# Vivado block design hdmi_directpassthr_woi, xc7z020clg484-1, Vivado 2017.2
# (continued, part 2 of 3)
current_bd_instance /color_video_pass/color_video_pass_fifo_wr_en
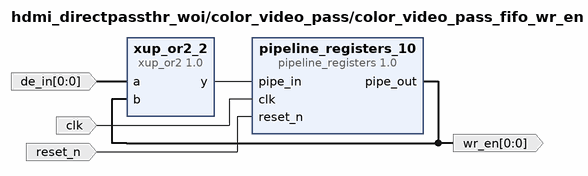
[diagram p24: block diagram inside /color_video_pass/color_video_pass_fifo_wr_en]
create_bd_pin -dir I clk
create_bd_pin -dir O -from 0 -to 0 wr_en
create_bd_pin -dir I -from 0 -to 0 de_in
create_bd_pin -dir I reset_n

create_bd_cell -type ip -vlnv SchuylerEldridge:user:pipeline_registers:1.0 pipeline_registers_10
set_property -dict {CONFIG.NUMBER_OF_STAGES 1 CONFIG.BIT_WIDTH 1} [get_bd_cells pipeline_registers_10]
create_bd_cell -type ip -vlnv xilinx.com:xup:xup_or2:1.0 xup_or2_2

# ---- hierarchy /color_video_pass/color_video_pass_fifo_rd_en ----
current_bd_instance /color_video_pass/color_video_pass_fifo_rd_en
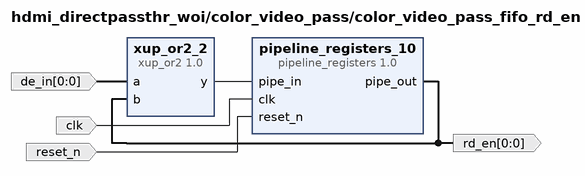
[diagram p25: block diagram inside /color_video_pass/color_video_pass_fifo_rd_en]
create_bd_pin -dir I clk
create_bd_pin -dir O -from 0 -to 0 rd_en
create_bd_pin -dir I -from 0 -to 0 de_in
create_bd_pin -dir I reset_n

create_bd_cell -type ip -vlnv SchuylerEldridge:user:pipeline_registers:1.0 pipeline_registers_10
set_property -dict {CONFIG.NUMBER_OF_STAGES 1 CONFIG.BIT_WIDTH 1} [get_bd_cells pipeline_registers_10]
create_bd_cell -type ip -vlnv xilinx.com:xup:xup_or2:1.0 xup_or2_2

# ---- hierarchy /four_signal_registering2 ----
current_bd_instance /four_signal_registering2
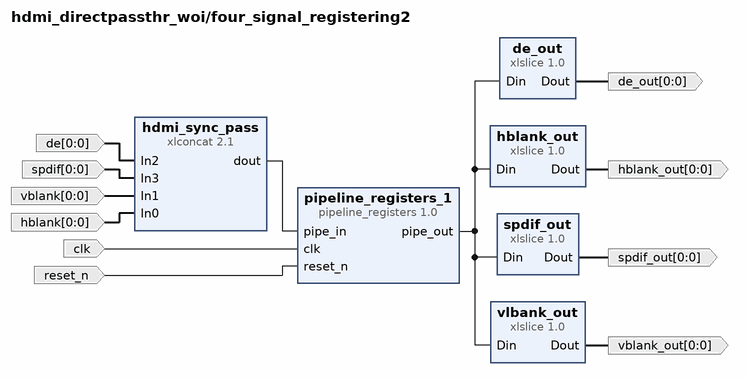
[diagram p26: block diagram inside /four_signal_registering2]
create_bd_pin -dir I -from 0 -to 0 de
create_bd_pin -dir I -from 0 -to 0 spdif
create_bd_pin -dir I -from 0 -to 0 vblank
create_bd_pin -dir I clk
create_bd_pin -dir I -from 0 -to 0 hblank
create_bd_pin -dir I reset_n
create_bd_pin -dir O -from 0 -to 0 hblank_out
create_bd_pin -dir O -from 0 -to 0 vblank_out
create_bd_pin -dir O -from 0 -to 0 de_out
create_bd_pin -dir O -from 0 -to 0 spdif_out

create_bd_cell -type ip -vlnv SchuylerEldridge:user:pipeline_registers:1.0 pipeline_registers_1
set_property -dict {CONFIG.NUMBER_OF_STAGES 1 CONFIG.BIT_WIDTH 4} [get_bd_cells pipeline_registers_1]
create_bd_cell -type ip -vlnv xilinx.com:ip:xlslice:1.0 de_out
set_property -dict {CONFIG.DIN_TO 2 CONFIG.DIN_FROM 2 CONFIG.DIN_WIDTH 4} [get_bd_cells de_out]
create_bd_cell -type ip -vlnv xilinx.com:ip:xlslice:1.0 hblank_out
set_property -dict {CONFIG.DIN_WIDTH 4} [get_bd_cells hblank_out]
create_bd_cell -type ip -vlnv xilinx.com:ip:xlconcat:2.1 hdmi_sync_pass
set_property -dict {CONFIG.NUM_PORTS 4 CONFIG.dout_width 4} [get_bd_cells hdmi_sync_pass]
create_bd_cell -type ip -vlnv xilinx.com:ip:xlslice:1.0 spdif_out
set_property -dict {CONFIG.DIN_TO 3 CONFIG.DIN_FROM 3 CONFIG.DIN_WIDTH 4} [get_bd_cells spdif_out]
create_bd_cell -type ip -vlnv xilinx.com:ip:xlslice:1.0 vlbank_out
set_property -dict {CONFIG.DIN_TO 1 CONFIG.DIN_FROM 1 CONFIG.DIN_WIDTH 4} [get_bd_cells vlbank_out]

# ---- hierarchy /fmc_imageon_hdmi_output_0 ----
current_bd_instance /fmc_imageon_hdmi_output_0
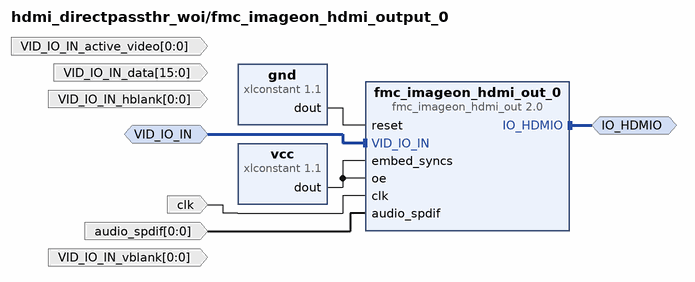
[diagram p27: block diagram inside /fmc_imageon_hdmi_output_0]
create_bd_intf_pin -mode Slave -vlnv xilinx.com:interface:vid_io_rtl:1.0 VID_IO_IN
create_bd_intf_pin -mode Master -vlnv avnet.com:interface:avnet_hdmi_rtl:1.0 IO_HDMIO
create_bd_pin -dir I clk
create_bd_pin -dir I -from 0 -to 0 audio_spdif
create_bd_pin -dir I -from 0 -to 0 VID_IO_IN_hblank
create_bd_pin -dir I -from 15 -to 0 VID_IO_IN_data
create_bd_pin -dir I -from 0 -to 0 VID_IO_IN_vblank
create_bd_pin -dir I -from 0 -to 0 VID_IO_IN_active_video

create_bd_cell -type ip -vlnv avnet:fmc_imageon:fmc_imageon_hdmi_out:2.0 fmc_imageon_hdmi_out_0
create_bd_cell -type ip -vlnv xilinx.com:ip:xlconstant:1.1 vcc
create_bd_cell -type ip -vlnv xilinx.com:ip:xlconstant:1.1 gnd

# ---- hierarchy /ycbcr2gray ----
current_bd_instance /ycbcr2gray
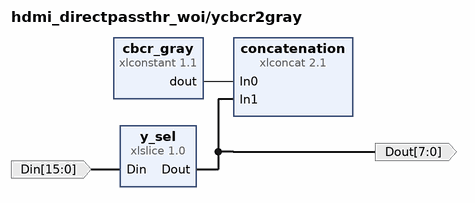
[diagram p28: block diagram inside /ycbcr2gray]
create_bd_pin -dir I -from 15 -to 0 Din
create_bd_pin -dir O -from 7 -to 0 Dout

create_bd_cell -type ip -vlnv xilinx.com:ip:xlconstant:1.1 cbcr_gray
set_property -dict {CONFIG.CONST_WIDTH 8 CONFIG.CONST_VAL 128} [get_bd_cells cbcr_gray]
create_bd_cell -type ip -vlnv xilinx.com:ip:xlconcat:2.1 concatenation
set_property -dict {CONFIG.IN0_WIDTH 8 CONFIG.IN1_WIDTH 8 CONFIG.dout_width 16} [get_bd_cells concatenation]
create_bd_cell -type ip -vlnv xilinx.com:ip:xlslice:1.0 y_sel
set_property -dict {CONFIG.DIN_TO 8 CONFIG.DIN_FROM 15 CONFIG.DIN_WIDTH 16 CONFIG.DOUT_WIDTH 8} [get_bd_cells y_sel]

# ---- hierarchy /ycbcr2mem_unit ----
current_bd_instance /ycbcr2mem_unit
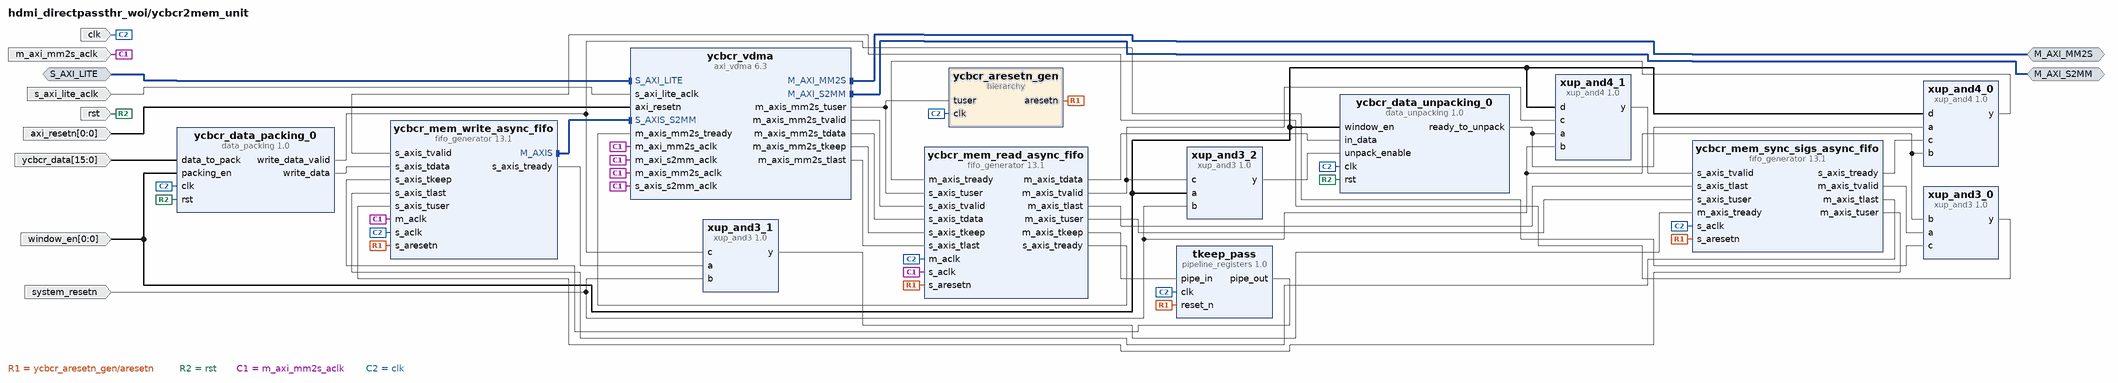
[diagram p29: block diagram inside /ycbcr2mem_unit]
create_bd_intf_pin -mode Slave -vlnv xilinx.com:interface:aximm_rtl:1.0 S_AXI_LITE
create_bd_intf_pin -mode Master -vlnv xilinx.com:interface:aximm_rtl:1.0 M_AXI_MM2S
create_bd_intf_pin -mode Master -vlnv xilinx.com:interface:aximm_rtl:1.0 M_AXI_S2MM
create_bd_pin -dir I -type clk s_axi_lite_aclk
create_bd_pin -dir I -from 0 -to 0 -type rst axi_resetn
create_bd_pin -dir I rst
create_bd_pin -dir I system_resetn
create_bd_pin -dir I -type clk m_axi_mm2s_aclk
create_bd_pin -dir I clk
create_bd_pin -dir I -from 0 -to 0 window_en
create_bd_pin -dir I -from 15 -to 0 ycbcr_data

create_bd_cell -type ip -vlnv xilinx.com:xup:xup_and4:1.0 xup_and4_0
create_bd_cell -type ip -vlnv xilinx.com:xup:xup_and3:1.0 xup_and3_0
create_bd_cell -type ip -vlnv xilinx.com:xup:xup_and4:1.0 xup_and4_1
create_bd_cell -type ip -vlnv xilinx.com:xup:xup_and3:1.0 xup_and3_1
create_bd_cell -type ip -vlnv xilinx.com:xup:xup_and3:1.0 xup_and3_2
create_bd_cell -type ip -vlnv NEU-ESL:user:data_unpacking:1.0 ycbcr_data_unpacking_0
create_bd_cell -type ip -vlnv NEU-ESL:user:data_packing:1.0 ycbcr_data_packing_0
set_property -dict {CONFIG.OUT_DATA_WIDTH 32 CONFIG.IN_DATA_WIDTH 16} [get_bd_cells ycbcr_data_packing_0]
create_bd_cell -type ip -vlnv SchuylerEldridge:user:pipeline_registers:1.0 tkeep_pass
set_property -dict {CONFIG.NUMBER_OF_STAGES 2 CONFIG.BIT_WIDTH 4} [get_bd_cells tkeep_pass]
create_bd_cell -type hier ycbcr_aresetn_gen
create_bd_cell -type ip -vlnv xilinx.com:ip:axi_vdma:6.3 ycbcr_vdma
set_property -dict [list \
  CONFIG.c_m_axi_mm2s_data_width 32 \
  CONFIG.c_m_axi_s2mm_data_width 32 \
  CONFIG.c_num_fstores 1 \
  CONFIG.c_use_s2mm_fsync 0 \
  CONFIG.c_mm2s_genlock_mode 0 \
  CONFIG.c_s2mm_genlock_mode 0 \
  CONFIG.c_mm2s_linebuffer_depth 4096 \
  CONFIG.c_s2mm_linebuffer_depth 4096 \
  CONFIG.c_mm2s_max_burst_length 256 \
  CONFIG.c_s2mm_max_burst_length 256 \
] [get_bd_cells ycbcr_vdma]
create_bd_cell -type ip -vlnv xilinx.com:ip:fifo_generator:13.1 ycbcr_mem_read_async_fifo
set_property -dict [list \
  CONFIG.INTERFACE_TYPE AXI_STREAM \
  CONFIG.Full_Flags_Reset_Value 1 \
  CONFIG.Clock_Type_AXI Independent_Clock \
  CONFIG.TDATA_NUM_BYTES 4 \
  CONFIG.TUSER_WIDTH 1 \
  CONFIG.Enable_TLAST true \
  CONFIG.HAS_TKEEP true \
  CONFIG.FIFO_Implementation_wach Independent_Clocks_Distributed_RAM \
  CONFIG.FIFO_Implementation_wdch Independent_Clocks_Block_RAM \
  CONFIG.FIFO_Implementation_wrch Independent_Clocks_Distributed_RAM \
  CONFIG.FIFO_Implementation_rach Independent_Clocks_Distributed_RAM \
  CONFIG.FIFO_Implementation_rdch Independent_Clocks_Block_RAM \
  CONFIG.FIFO_Implementation_axis Independent_Clocks_Block_RAM \
  CONFIG.Input_Depth_axis 512 \
  CONFIG.Underflow_Flag_AXI true \
  CONFIG.Overflow_Flag_AXI true \
] [get_bd_cells ycbcr_mem_read_async_fifo]
create_bd_cell -type ip -vlnv xilinx.com:ip:fifo_generator:13.1 ycbcr_mem_sync_sigs_async_fifo
set_property -dict [list \
  CONFIG.INTERFACE_TYPE AXI_STREAM \
  CONFIG.Full_Flags_Reset_Value 1 \
  CONFIG.Clock_Type_AXI Common_Clock \
  CONFIG.TDATA_NUM_BYTES 0 \
  CONFIG.TUSER_WIDTH 1 \
  CONFIG.Enable_TLAST true \
  CONFIG.FIFO_Implementation_wach Common_Clock_Distributed_RAM \
  CONFIG.FIFO_Implementation_wrch Common_Clock_Distributed_RAM \
  CONFIG.FIFO_Implementation_rach Common_Clock_Distributed_RAM \
  CONFIG.Input_Depth_axis 16 \
  CONFIG.Underflow_Flag_AXI true \
  CONFIG.Overflow_Flag_AXI true \
] [get_bd_cells ycbcr_mem_sync_sigs_async_fifo]
create_bd_cell -type ip -vlnv xilinx.com:ip:fifo_generator:13.1 ycbcr_mem_write_async_fifo
set_property -dict [list \
  CONFIG.INTERFACE_TYPE AXI_STREAM \
  CONFIG.Full_Flags_Reset_Value 1 \
  CONFIG.Clock_Type_AXI Independent_Clock \
  CONFIG.TDATA_NUM_BYTES 4 \
  CONFIG.TUSER_WIDTH 1 \
  CONFIG.Enable_TLAST true \
  CONFIG.HAS_TKEEP true \
  CONFIG.FIFO_Implementation_wach Independent_Clocks_Distributed_RAM \
  CONFIG.FIFO_Implementation_wdch Independent_Clocks_Block_RAM \
  CONFIG.FIFO_Implementation_wrch Independent_Clocks_Distributed_RAM \
  CONFIG.FIFO_Implementation_rach Independent_Clocks_Distributed_RAM \
  CONFIG.FIFO_Implementation_rdch Independent_Clocks_Block_RAM \
  CONFIG.FIFO_Implementation_axis Independent_Clocks_Block_RAM \
  CONFIG.Input_Depth_axis 512 \
  CONFIG.Underflow_Flag_AXI true \
  CONFIG.Overflow_Flag_AXI true \
] [get_bd_cells ycbcr_mem_write_async_fifo]

# ---- hierarchy /ycbcr2mem_unit/ycbcr_aresetn_gen ----
current_bd_instance /ycbcr2mem_unit/ycbcr_aresetn_gen
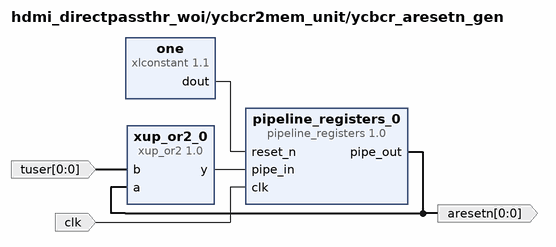
[diagram p30: block diagram inside /ycbcr2mem_unit/ycbcr_aresetn_gen]
create_bd_pin -dir I clk
create_bd_pin -dir I -from 0 -to 0 tuser
create_bd_pin -dir O -from 0 -to 0 aresetn

create_bd_cell -type ip -vlnv xilinx.com:xup:xup_or2:1.0 xup_or2_0
create_bd_cell -type ip -vlnv SchuylerEldridge:user:pipeline_registers:1.0 pipeline_registers_0
set_property -dict {CONFIG.NUMBER_OF_STAGES 1 CONFIG.BIT_WIDTH 1} [get_bd_cells pipeline_registers_0]
create_bd_cell -type ip -vlnv xilinx.com:ip:xlconstant:1.1 one

# ---- hierarchy /smth_pass_sel ----
current_bd_instance /smth_pass_sel
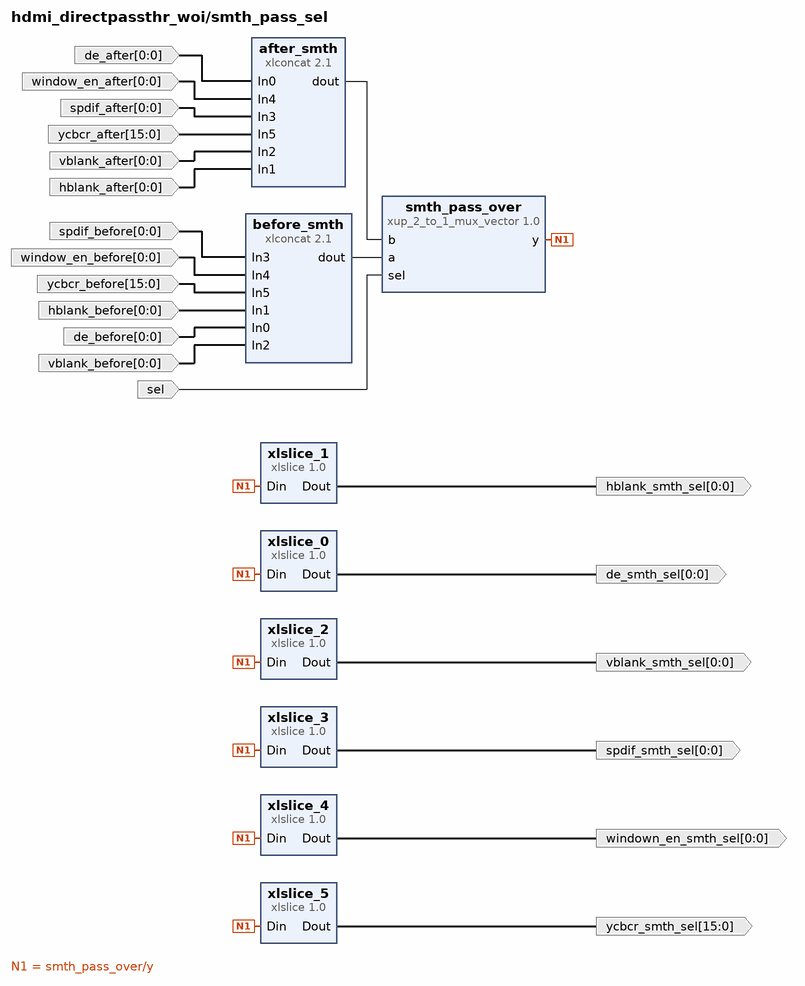
[diagram p31: block diagram inside /smth_pass_sel]
create_bd_pin -dir I -from 0 -to 0 de_after
create_bd_pin -dir I -from 0 -to 0 window_en_after
create_bd_pin -dir I -from 0 -to 0 spdif_after
create_bd_pin -dir I -from 15 -to 0 ycbcr_after
create_bd_pin -dir I -from 0 -to 0 vblank_after
create_bd_pin -dir I -from 0 -to 0 hblank_after
create_bd_pin -dir I -from 0 -to 0 spdif_before
create_bd_pin -dir I -from 0 -to 0 window_en_before
create_bd_pin -dir I -from 15 -to 0 ycbcr_before
create_bd_pin -dir I -from 0 -to 0 hblank_before
create_bd_pin -dir I -from 0 -to 0 de_before
create_bd_pin -dir I -from 0 -to 0 vblank_before
create_bd_pin -dir I sel
create_bd_pin -dir O -from 0 -to 0 hblank_smth_sel
create_bd_pin -dir O -from 0 -to 0 de_smth_sel
create_bd_pin -dir O -from 0 -to 0 vblank_smth_sel
create_bd_pin -dir O -from 0 -to 0 spdif_smth_sel
create_bd_pin -dir O -from 0 -to 0 windown_en_smth_sel
create_bd_pin -dir O -from 15 -to 0 ycbcr_smth_sel

create_bd_cell -type ip -vlnv xilinx.com:xup:xup_2_to_1_mux_vector:1.0 smth_pass_over
set_property -dict {CONFIG.DELAY 0 CONFIG.SIZE 21} [get_bd_cells smth_pass_over]
create_bd_cell -type ip -vlnv xilinx.com:ip:xlconcat:2.1 before_smth
set_property -dict {CONFIG.NUM_PORTS 6 CONFIG.IN5_WIDTH 16 CONFIG.dout_width 21} [get_bd_cells before_smth]
create_bd_cell -type ip -vlnv xilinx.com:ip:xlconcat:2.1 after_smth
set_property -dict {CONFIG.NUM_PORTS 6 CONFIG.IN5_WIDTH 16 CONFIG.dout_width 21} [get_bd_cells after_smth]
create_bd_cell -type ip -vlnv xilinx.com:ip:xlslice:1.0 xlslice_0
set_property -dict {CONFIG.DIN_WIDTH 21} [get_bd_cells xlslice_0]
create_bd_cell -type ip -vlnv xilinx.com:ip:xlslice:1.0 xlslice_1
set_property -dict {CONFIG.DIN_TO 1 CONFIG.DIN_FROM 1 CONFIG.DIN_WIDTH 21} [get_bd_cells xlslice_1]
create_bd_cell -type ip -vlnv xilinx.com:ip:xlslice:1.0 xlslice_2
set_property -dict {CONFIG.DIN_TO 2 CONFIG.DIN_FROM 2 CONFIG.DIN_WIDTH 21} [get_bd_cells xlslice_2]
create_bd_cell -type ip -vlnv xilinx.com:ip:xlslice:1.0 xlslice_3
set_property -dict {CONFIG.DIN_TO 3 CONFIG.DIN_FROM 3 CONFIG.DIN_WIDTH 21} [get_bd_cells xlslice_3]
create_bd_cell -type ip -vlnv xilinx.com:ip:xlslice:1.0 xlslice_4
set_property -dict {CONFIG.DIN_TO 4 CONFIG.DIN_FROM 4 CONFIG.DIN_WIDTH 21} [get_bd_cells xlslice_4]
create_bd_cell -type ip -vlnv xilinx.com:ip:xlslice:1.0 xlslice_5
set_property -dict {CONFIG.DIN_TO 5 CONFIG.DIN_FROM 20 CONFIG.DIN_WIDTH 21 CONFIG.DOUT_WIDTH 16} [get_bd_cells xlslice_5]

# ---- hierarchy /morph_pass_sel ----
current_bd_instance /morph_pass_sel
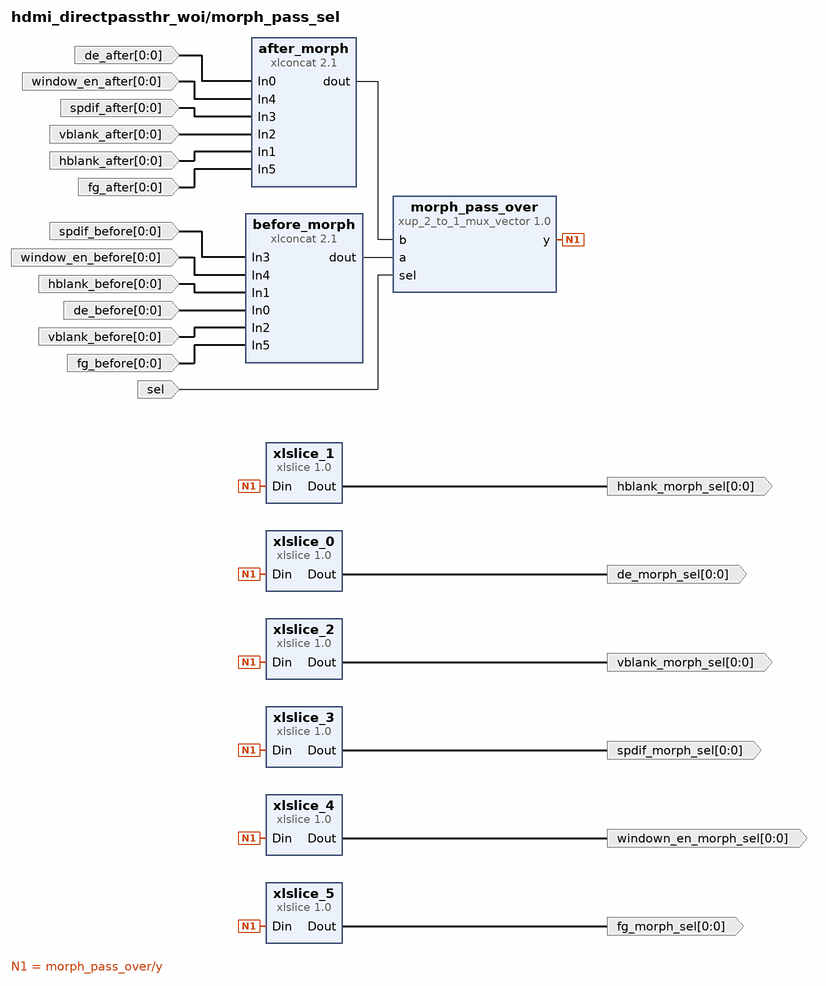
[diagram p32: block diagram inside /morph_pass_sel]
create_bd_pin -dir I -from 0 -to 0 de_after
create_bd_pin -dir I -from 0 -to 0 window_en_after
create_bd_pin -dir I -from 0 -to 0 spdif_after
create_bd_pin -dir I -from 0 -to 0 vblank_after
create_bd_pin -dir I -from 0 -to 0 hblank_after
create_bd_pin -dir I -from 0 -to 0 spdif_before
create_bd_pin -dir I -from 0 -to 0 window_en_before
create_bd_pin -dir I -from 0 -to 0 hblank_before
create_bd_pin -dir I -from 0 -to 0 de_before
create_bd_pin -dir I -from 0 -to 0 vblank_before
create_bd_pin -dir I sel
create_bd_pin -dir O -from 0 -to 0 hblank_morph_sel
create_bd_pin -dir O -from 0 -to 0 de_morph_sel
create_bd_pin -dir O -from 0 -to 0 vblank_morph_sel
create_bd_pin -dir O -from 0 -to 0 spdif_morph_sel
create_bd_pin -dir O -from 0 -to 0 windown_en_morph_sel
create_bd_pin -dir I -from 0 -to 0 fg_before
create_bd_pin -dir I -from 0 -to 0 fg_after
create_bd_pin -dir O -from 0 -to 0 fg_morph_sel

create_bd_cell -type ip -vlnv xilinx.com:xup:xup_2_to_1_mux_vector:1.0 morph_pass_over
set_property -dict {CONFIG.DELAY 0 CONFIG.SIZE 6} [get_bd_cells morph_pass_over]
create_bd_cell -type ip -vlnv xilinx.com:ip:xlconcat:2.1 after_morph
set_property -dict {CONFIG.NUM_PORTS 6 CONFIG.IN5_WIDTH 1 CONFIG.dout_width 6} [get_bd_cells after_morph]
create_bd_cell -type ip -vlnv xilinx.com:ip:xlconcat:2.1 before_morph
set_property -dict {CONFIG.NUM_PORTS 6 CONFIG.IN5_WIDTH 1 CONFIG.dout_width 6} [get_bd_cells before_morph]
create_bd_cell -type ip -vlnv xilinx.com:ip:xlslice:1.0 xlslice_0
set_property -dict {CONFIG.DIN_WIDTH 6} [get_bd_cells xlslice_0]
create_bd_cell -type ip -vlnv xilinx.com:ip:xlslice:1.0 xlslice_1
set_property -dict {CONFIG.DIN_TO 1 CONFIG.DIN_FROM 1 CONFIG.DIN_WIDTH 6} [get_bd_cells xlslice_1]
create_bd_cell -type ip -vlnv xilinx.com:ip:xlslice:1.0 xlslice_2
set_property -dict {CONFIG.DIN_TO 2 CONFIG.DIN_FROM 2 CONFIG.DIN_WIDTH 6} [get_bd_cells xlslice_2]
create_bd_cell -type ip -vlnv xilinx.com:ip:xlslice:1.0 xlslice_3
set_property -dict {CONFIG.DIN_TO 3 CONFIG.DIN_FROM 3 CONFIG.DIN_WIDTH 6} [get_bd_cells xlslice_3]
create_bd_cell -type ip -vlnv xilinx.com:ip:xlslice:1.0 xlslice_4
set_property -dict {CONFIG.DIN_TO 4 CONFIG.DIN_FROM 4 CONFIG.DIN_WIDTH 6} [get_bd_cells xlslice_4]
create_bd_cell -type ip -vlnv xilinx.com:ip:xlslice:1.0 xlslice_5
set_property -dict {CONFIG.DIN_TO 5 CONFIG.DIN_FROM 5 CONFIG.DIN_WIDTH 6} [get_bd_cells xlslice_5]

# ---- connections ----

current_bd_instance /four_signal_registering
connect_bd_net [get_bd_pins pipeline_registers_1/pipe_out] \
  [get_bd_pins hblank_out/Din] [get_bd_pins vlbank_out/Din] [get_bd_pins de_out/Din] [get_bd_pins spdif_out/Din]
connect_bd_net [get_bd_pins hdmi_sync_pass/dout] [get_bd_pins pipeline_registers_1/pipe_in]
connect_bd_net -net fmc_imageon_hdmi_in_unit0_video_de [get_bd_pins In2] [get_bd_pins hdmi_sync_pass/In2]
connect_bd_net -net fmc_imageon_hdmi_in_unit0_audio_spdif [get_bd_pins In3] [get_bd_pins hdmi_sync_pass/In3]
connect_bd_net -net fmc_imageon_hdmi_in_unit0_video_vblank [get_bd_pins In1] [get_bd_pins hdmi_sync_pass/In1]
connect_bd_net [get_bd_pins clk] [get_bd_pins pipeline_registers_1/clk]
connect_bd_net -net fmc_imageon_hdmi_in_unit0_video_hblank [get_bd_pins In0] [get_bd_pins hdmi_sync_pass/In0]
connect_bd_net -net vbb_system_reset_0_system_reset_n [get_bd_pins reset_n] [get_bd_pins pipeline_registers_1/reset_n]
connect_bd_net [get_bd_pins hblank_out/Dout] [get_bd_pins Dout]
connect_bd_net [get_bd_pins vlbank_out/Dout] [get_bd_pins Dout1]
connect_bd_net [get_bd_pins de_out/Dout] [get_bd_pins Dout2]
connect_bd_net [get_bd_pins spdif_out/Dout] [get_bd_pins Dout3]

current_bd_instance /four_signal_registering1
connect_bd_net [get_bd_pins pipeline_registers_1/pipe_out] \
  [get_bd_pins de_out/Din] [get_bd_pins hblank_out/Din] [get_bd_pins spdif_out/Din] [get_bd_pins vlbank_out/Din]
connect_bd_net [get_bd_pins hdmi_sync_pass/dout] [get_bd_pins pipeline_registers_1/pipe_in]
connect_bd_net -net fmc_imageon_hdmi_in_unit0_video_de [get_bd_pins de] [get_bd_pins hdmi_sync_pass/In2]
connect_bd_net -net fmc_imageon_hdmi_in_unit0_audio_spdif [get_bd_pins spdif] [get_bd_pins hdmi_sync_pass/In3]
connect_bd_net -net fmc_imageon_hdmi_in_unit0_video_vblank [get_bd_pins vblank] [get_bd_pins hdmi_sync_pass/In1]
connect_bd_net [get_bd_pins clk] [get_bd_pins pipeline_registers_1/clk]
connect_bd_net -net fmc_imageon_hdmi_in_unit0_video_hblank [get_bd_pins hblank] [get_bd_pins hdmi_sync_pass/In0]
connect_bd_net -net vbb_system_reset_0_system_reset_n [get_bd_pins reset_n] [get_bd_pins pipeline_registers_1/reset_n]
connect_bd_net [get_bd_pins hblank_out/Dout] [get_bd_pins Dout]
connect_bd_net [get_bd_pins vlbank_out/Dout] [get_bd_pins Dout1]
connect_bd_net [get_bd_pins de_out/Dout] [get_bd_pins Dout2]
connect_bd_net [get_bd_pins spdif_out/Dout] [get_bd_pins Dout3]

current_bd_instance /video_overlay_unit
connect_bd_intf_net [get_bd_intf_pins vovrly_vdma/S_AXIS_S2MM] [get_bd_intf_pins vovraly_wr_async_fifo/M_AXIS]
connect_bd_intf_net [get_bd_intf_pins M_AXI_MM2S] [get_bd_intf_pins vovrly_vdma/M_AXI_MM2S]
connect_bd_intf_net [get_bd_intf_pins S_AXI_LITE] [get_bd_intf_pins vovrly_vdma/S_AXI_LITE]
connect_bd_intf_net [get_bd_intf_pins M_AXI_S2MM] [get_bd_intf_pins vovrly_vdma/M_AXI_S2MM]
connect_bd_intf_net [get_bd_intf_pins S_AXI] [get_bd_intf_pins vovrlay_woi_det/S_AXI]
connect_bd_net -net data_unpacking_0_video_overlay_set [get_bd_pins vovrly_data_unpacking0/out_data] \
  [get_bd_pins video_overlay_set] [get_bd_pins video_overlay_0/vovrlay_is_fg]
connect_bd_net [get_bd_pins pipeline_registers_1/pipe_out] [get_bd_pins video_overlay_0/video_grayscale_data]
connect_bd_net [get_bd_pins pipeline_registers_2/pipe_out] [get_bd_pins video_overlay_0/mog_window_enable]
connect_bd_net -net processing_system7_0_FCLK_CLK0 [get_bd_pins s_axi_lite_aclk] \
  [get_bd_pins vovrlay_woi_det/s_axi_aclk] [get_bd_pins vovrly_vdma/s_axi_lite_aclk]
connect_bd_net -net clk_1 [get_bd_pins hdmi_clk] \
  [get_bd_pins pipeline_registers_2/clk] [get_bd_pins pipeline_registers_1/clk] [get_bd_pins pipeline_registers_3/clk] \
  [get_bd_pins vovrlay_data_packing_0/clk] [get_bd_pins pipeline_registers_5/clk] [get_bd_pins pipeline_registers_6/clk] \
  [get_bd_pins vovrly_data_unpacking0/clk] [get_bd_pins pipeline_registers_0/clk] [get_bd_pins pipeline_registers_4/clk] \
  [get_bd_pins vovrlay_woi_det/clk] [get_bd_pins vovraly_rd_async_fifo/m_aclk] [get_bd_pins vovrly_sync_sigs_pass/s_aclk] \
  [get_bd_pins vovraly_wr_async_fifo/s_aclk] [get_bd_pins video_overlay_0/clk]
connect_bd_net -net vbb_system_reset_0_system_reset [get_bd_pins system_reset] \
  [get_bd_pins vovrlay_data_packing_0/rst] [get_bd_pins vovrly_data_unpacking0/rst] [get_bd_pins vovrlay_woi_det/rst] \
  [get_bd_pins video_overlay_0/rst]
connect_bd_net -net vbb_system_reset_0_system_reset_n [get_bd_pins system_reset_n] \
  [get_bd_pins pipeline_registers_1/reset_n] [get_bd_pins pipeline_registers_2/reset_n] [get_bd_pins xup_and3_1/b] \
  [get_bd_pins pipeline_registers_3/reset_n] [get_bd_pins xup_and3_3/c] [get_bd_pins xup_and3_2/c] [get_bd_pins xup_and4_1/d] \
  [get_bd_pins xup_and4_0/d] [get_bd_pins pipeline_registers_6/reset_n]
connect_bd_net -net processing_system7_0_FCLK_CLK1 [get_bd_pins axi_clk] \
  [get_bd_pins vovrly_vdma/m_axi_mm2s_aclk] [get_bd_pins vovrly_vdma/m_axis_mm2s_aclk] \
  [get_bd_pins vovrly_vdma/m_axi_s2mm_aclk] [get_bd_pins vovrly_vdma/s_axis_s2mm_aclk] \
  [get_bd_pins vovraly_rd_async_fifo/s_aclk] [get_bd_pins vovraly_wr_async_fifo/m_aclk] \
  [get_bd_pins vovrly_async_fifo_rst/clk]
connect_bd_net -net fifo_generator_0_m_axis_tdata [get_bd_pins vovraly_rd_async_fifo/m_axis_tdata] \
  [get_bd_pins m_axis_tdata] [get_bd_pins vovrly_data_unpacking0/in_data]
connect_bd_net -net image_smoothing_full_version_0_win_enable_out [get_bd_pins mog_window_enable] [get_bd_pins pipeline_registers_2/pipe_in]
connect_bd_net -net image_smoothing_full_version_0_data_out [get_bd_pins grayscale_pixel_in_orig] [get_bd_pins pipeline_registers_1/pipe_in]
connect_bd_net [get_bd_pins vovrlay_woi_det/window_enable] \
  [get_bd_pins window_enable] [get_bd_pins xup_and3_1/a] [get_bd_pins xup_and4_1/c] [get_bd_pins xup_and4_0/c] \
  [get_bd_pins vovrlay_data_packing_0/packing_en] [get_bd_pins vovrly_data_unpacking0/window_en] \
  [get_bd_pins video_overlay_0/video_overlay_window_enable]
connect_bd_net -net axi_vdma_0_m_axis_mm2s_tdata [get_bd_pins vovrly_vdma/m_axis_mm2s_tdata] [get_bd_pins vovraly_rd_async_fifo/s_axis_tdata]
connect_bd_net [get_bd_pins vovraly_rd_async_fifo/s_axis_tready] [get_bd_pins vovrly_vdma/m_axis_mm2s_tready]
connect_bd_net -net axi_vdma_0_m_axis_mm2s_tvalid [get_bd_pins vovrly_vdma/m_axis_mm2s_tvalid] [get_bd_pins vovraly_rd_async_fifo/s_axis_tvalid]
connect_bd_net [get_bd_pins axi_resetn] [get_bd_pins vovrlay_woi_det/s_axi_aresetn] [get_bd_pins vovrly_vdma/axi_resetn]
connect_bd_net -net data_unpacking_0_ready_to_unpack [get_bd_pins vovrly_data_unpacking0/ready_to_unpack] \
  [get_bd_pins ready_to_unpack] [get_bd_pins xup_and4_1/a] [get_bd_pins xup_and4_0/a]
connect_bd_net -net axi_vdma_0_m_axis_mm2s_tkeep [get_bd_pins vovrly_vdma/m_axis_mm2s_tkeep] [get_bd_pins vovraly_rd_async_fifo/s_axis_tkeep]
connect_bd_net [get_bd_pins xup_and3_1/y] [get_bd_pins unpack_enable] [get_bd_pins vovrly_data_unpacking0/unpack_enable]
connect_bd_net [get_bd_pins vovrly_async_fifo_rst/aresetn] \
  [get_bd_pins pipeline_registers_5/reset_n] [get_bd_pins pipeline_registers_0/reset_n] \
  [get_bd_pins pipeline_registers_4/reset_n] [get_bd_pins vovraly_rd_async_fifo/s_aresetn] \
  [get_bd_pins vovrly_sync_sigs_pass/s_aresetn] [get_bd_pins vovraly_wr_async_fifo/s_aresetn]
connect_bd_net -net axi_vdma_0_m_axis_mm2s_tuser [get_bd_pins vovrly_vdma/m_axis_mm2s_tuser] \
  [get_bd_pins vovraly_rd_async_fifo/s_axis_tuser] [get_bd_pins vovrly_async_fifo_rst/tuser]
connect_bd_net [get_bd_pins vovraly_rd_async_fifo/m_axis_tvalid] [get_bd_pins xup_and3_1/c] [get_bd_pins xup_and4_0/b]
connect_bd_net -net pipe_in2_1 [get_bd_pins is_fg] [get_bd_pins pipeline_registers_3/pipe_in]
connect_bd_net [get_bd_pins pipeline_registers_3/pipe_out] [get_bd_pins vovrlay_data_packing_0/data_to_pack] [get_bd_pins video_overlay_0/mog_is_fg]
connect_bd_net [get_bd_pins xup_and4_0/y] [get_bd_pins vovrly_sync_sigs_pass/s_axis_tvalid]
connect_bd_net -net data_packing_0_write_data_valid [get_bd_pins vovrlay_data_packing_0/write_data_valid] \
  [get_bd_pins xup_and3_2/a] [get_bd_pins xup_and3_3/a]
connect_bd_net [get_bd_pins vovraly_wr_async_fifo/s_axis_tready] [get_bd_pins xup_and3_2/b]
connect_bd_net -net xup_and3_0_y_1 [get_bd_pins xup_and3_2/y] [get_bd_pins vovrly_sync_sigs_pass/m_axis_tready]
connect_bd_net [get_bd_pins vovrly_sync_sigs_pass/m_axis_tvalid] [get_bd_pins xup_and3_3/b]
connect_bd_net -net xup_and3_1_y_1 [get_bd_pins xup_and3_3/y] [get_bd_pins vovraly_wr_async_fifo/s_axis_tvalid]
connect_bd_net [get_bd_pins vovrly_sync_sigs_pass/s_axis_tready] [get_bd_pins xup_and4_1/b]
connect_bd_net -net data_packing_0_write_data [get_bd_pins vovrlay_data_packing_0/write_data] [get_bd_pins vovraly_wr_async_fifo/s_axis_tdata]
connect_bd_net [get_bd_pins xup_and4_1/y] [get_bd_pins vovraly_rd_async_fifo/m_axis_tready]
connect_bd_net [get_bd_pins vovraly_rd_async_fifo/m_axis_tkeep] [get_bd_pins pipeline_registers_5/pipe_in]
connect_bd_net [get_bd_pins pipeline_registers_5/pipe_out] [get_bd_pins vovraly_wr_async_fifo/s_axis_tkeep]
connect_bd_net [get_bd_pins vovrly_sync_sigs_pass/m_axis_tlast] [get_bd_pins vovraly_wr_async_fifo/s_axis_tlast]
connect_bd_net [get_bd_pins vovrly_sync_sigs_pass/m_axis_tuser] [get_bd_pins vovraly_wr_async_fifo/s_axis_tuser]
connect_bd_net [get_bd_pins vovrly_vdma/m_axis_mm2s_tlast] [get_bd_pins vovraly_rd_async_fifo/s_axis_tlast]
connect_bd_net [get_bd_pins vovraly_rd_async_fifo/m_axis_tlast] [get_bd_pins vovrly_sync_sigs_pass/s_axis_tlast]
connect_bd_net [get_bd_pins vovraly_rd_async_fifo/m_axis_tuser] [get_bd_pins vovrly_sync_sigs_pass/s_axis_tuser]
connect_bd_net [get_bd_pins pipeline_registers_6/pipe_out] [get_bd_pins video_overlay_0/video_color_data]
connect_bd_net -net pipe_in_1 [get_bd_pins ycbcr_data_in_orig] [get_bd_pins pipeline_registers_6/pipe_in]
connect_bd_net [get_bd_pins input_video_vblank] [get_bd_pins vovrlay_woi_det/input_video_vblank]
connect_bd_net [get_bd_pins input_video_hblank] [get_bd_pins vovrlay_woi_det/input_video_hblank]
connect_bd_net [get_bd_pins video_grayscale_data_smth] [get_bd_pins pipeline_registers_0/pipe_in]
connect_bd_net [get_bd_pins video_color_data_smth] [get_bd_pins pipeline_registers_4/pipe_in]
connect_bd_net [get_bd_pins vovrly_vdma/mm2s_introut] [get_bd_pins mm2s_introut]
connect_bd_net [get_bd_pins vovrly_vdma/s2mm_introut] [get_bd_pins s2mm_introut]
connect_bd_net [get_bd_pins video_overlay_0/video_data_out] [get_bd_pins video_data_out]
connect_bd_net [get_bd_pins output_source] [get_bd_pins video_overlay_0/output_source]

current_bd_instance /video_overlay_unit/vovrly_async_fifo_rst
connect_bd_net [get_bd_pins xlconstant_1/dout] [get_bd_pins pipeline_registers_10/reset_n]
connect_bd_net [get_bd_pins xup_or2_2/y] [get_bd_pins pipeline_registers_10/pipe_in]
connect_bd_net [get_bd_pins pipeline_registers_10/pipe_out] [get_bd_pins aresetn] [get_bd_pins xup_or2_2/b]
connect_bd_net -net processing_system7_0_FCLK_CLK1 [get_bd_pins clk] [get_bd_pins pipeline_registers_10/clk]
connect_bd_net -net video_overlay_unit_m_axis_mm2s_tuser [get_bd_pins tuser] [get_bd_pins xup_or2_2/a]

current_bd_instance /bge_unit
connect_bd_intf_net [get_bd_intf_pins mog_params_write_async_fifo/M_AXIS] [get_bd_intf_pins mog_vdma/S_AXIS_S2MM]
connect_bd_intf_net [get_bd_intf_pins S_AXI_LITE] [get_bd_intf_pins mog_vdma/S_AXI_LITE]
connect_bd_intf_net [get_bd_intf_pins M_AXI_MM2S] [get_bd_intf_pins mog_vdma/M_AXI_MM2S]
connect_bd_intf_net [get_bd_intf_pins M_AXI_S2MM] [get_bd_intf_pins mog_vdma/M_AXI_S2MM]
connect_bd_intf_net [get_bd_intf_pins S_AXI] [get_bd_intf_pins MixtureOfGaussians_0/S_AXI]
connect_bd_net [get_bd_pins mog_async_fifo_rst/aresetn] \
  [get_bd_pins pipeline_registers_1/reset_n] [get_bd_pins mog_params_read_async_fifo/s_aresetn] \
  [get_bd_pins mog_params_write_async_fifo/s_aresetn] [get_bd_pins vdma_sync_signals_passing/s_aresetn]
connect_bd_net [get_bd_pins mog_params_packing/dout] [get_bd_pins mog_params_write_async_fifo/s_axis_tdata]
connect_bd_net [get_bd_pins pipeline_registers_1/pipe_out] [get_bd_pins mog_params_write_async_fifo/s_axis_tkeep]
connect_bd_net [get_bd_pins mog_vdma/m_axis_mm2s_tvalid] [get_bd_pins mog_params_read_async_fifo/s_axis_tvalid]
connect_bd_net [get_bd_pins mog_params_read_async_fifo/s_axis_tready] [get_bd_pins mog_vdma/m_axis_mm2s_tready]
connect_bd_net [get_bd_pins mog_vdma/m_axis_mm2s_tdata] [get_bd_pins mog_params_read_async_fifo/s_axis_tdata]
connect_bd_net [get_bd_pins mog_vdma/m_axis_mm2s_tkeep] [get_bd_pins mog_params_read_async_fifo/s_axis_tkeep]
connect_bd_net [get_bd_pins mog_params_read_async_fifo/m_axis_tdata] [get_bd_pins mog_params_extraction/params]
connect_bd_net [get_bd_pins mog_params_read_async_fifo/m_axis_tkeep] [get_bd_pins pipeline_registers_1/pipe_in]
connect_bd_net -net xlconstant_0_dout [get_bd_pins zero24/dout] [get_bd_pins grayscale8to32/In0]
connect_bd_net -net xlconcat_0_dout [get_bd_pins grayscale8to32/dout] [get_bd_pins MixtureOfGaussians_0/gp]
connect_bd_net -net mean1_concat_dout [get_bd_pins mog_params_extraction/mean3] [get_bd_pins MixtureOfGaussians_0/mean1]
connect_bd_net -net mean2_selection_dout [get_bd_pins mog_params_extraction/sd2] [get_bd_pins MixtureOfGaussians_0/mean2]
connect_bd_net -net mean3_selection_dout [get_bd_pins mog_params_extraction/sd1] [get_bd_pins MixtureOfGaussians_0/mean3]
connect_bd_net -net sd1_selection_dout [get_bd_pins mog_params_extraction/mean2] [get_bd_pins MixtureOfGaussians_0/sd1]
connect_bd_net -net sd2_selection_dout [get_bd_pins mog_params_extraction/sd3] [get_bd_pins MixtureOfGaussians_0/sd2]
connect_bd_net -net sd3_selection_dout [get_bd_pins mog_params_extraction/mean1] [get_bd_pins MixtureOfGaussians_0/sd3]
connect_bd_net -net w1_selection_dout [get_bd_pins mog_params_extraction/w1] [get_bd_pins MixtureOfGaussians_0/w1]
connect_bd_net -net w2_selection_dout [get_bd_pins mog_params_extraction/w2] [get_bd_pins MixtureOfGaussians_0/w2]
connect_bd_net [get_bd_pins mog_vdma/m_axis_mm2s_tuser] [get_bd_pins mog_params_read_async_fifo/s_axis_tuser] [get_bd_pins mog_async_fifo_rst/tuser]
connect_bd_net -net vbb_system_reset_0_system_reset [get_bd_pins system_reset] [get_bd_pins MixtureOfGaussians_0/rst]
connect_bd_net -net vbb_system_reset_0_system_reset_n [get_bd_pins system_reset_n] \
  [get_bd_pins xup_and3_0/c] [get_bd_pins xup_and3_1/c] [get_bd_pins xup_and3_2/b] [get_bd_pins xup_and3_3/b]
connect_bd_net -net clk_1 [get_bd_pins hdmi_clk] \
  [get_bd_pins pipeline_registers_1/clk] [get_bd_pins MixtureOfGaussians_0/clk] \
  [get_bd_pins mog_params_read_async_fifo/m_aclk] [get_bd_pins mog_params_write_async_fifo/s_aclk] \
  [get_bd_pins vdma_sync_signals_passing/s_aclk]
connect_bd_net -net processing_system7_0_FCLK_CLK1 [get_bd_pins axi_clk] \
  [get_bd_pins mog_vdma/m_axi_mm2s_aclk] [get_bd_pins mog_vdma/m_axis_mm2s_aclk] [get_bd_pins mog_vdma/m_axi_s2mm_aclk] \
  [get_bd_pins mog_vdma/s_axis_s2mm_aclk] [get_bd_pins mog_params_read_async_fifo/s_aclk] \
  [get_bd_pins mog_params_write_async_fifo/m_aclk]
connect_bd_net -net pipe_in1_1 [get_bd_pins grayscale_pixel_in] [get_bd_pins grayscale8to32/In1]
connect_bd_net -net window_en [get_bd_pins window_enable] \
  [get_bd_pins xup_and3_0/b] [get_bd_pins xup_and3_1/b] [get_bd_pins MixtureOfGaussians_0/window_en]
connect_bd_net -net MixtureOfGuassians_0_window_en_out [get_bd_pins MixtureOfGaussians_0/window_en_out] \
  [get_bd_pins window_enable_out] [get_bd_pins xup_and3_2/c] [get_bd_pins xup_and3_3/a]
connect_bd_net [get_bd_pins xlslice_0/Dout] [get_bd_pins grayscale_pixel_out]
connect_bd_net -net mog_params_extraction_dout [get_bd_pins mog_params_extraction/w3] [get_bd_pins MixtureOfGaussians_0/w3]
connect_bd_net [get_bd_pins mog_vdma/m_axis_mm2s_tlast] [get_bd_pins mog_params_read_async_fifo/s_axis_tlast]
connect_bd_net [get_bd_pins mog_params_read_async_fifo/m_axis_tlast] [get_bd_pins vdma_sync_signals_passing/s_axis_tlast]
connect_bd_net [get_bd_pins mog_params_read_async_fifo/m_axis_tuser] [get_bd_pins vdma_sync_signals_passing/s_axis_tuser]
connect_bd_net [get_bd_pins xup_and3_0/y] [get_bd_pins mog_params_read_async_fifo/m_axis_tready]
connect_bd_net [get_bd_pins vdma_sync_signals_passing/s_axis_tready] [get_bd_pins xup_and3_0/a]
connect_bd_net [get_bd_pins mog_params_read_async_fifo/m_axis_tvalid] [get_bd_pins xup_and3_1/a]
connect_bd_net [get_bd_pins xup_and3_1/y] [get_bd_pins vdma_sync_signals_passing/s_axis_tvalid]
connect_bd_net [get_bd_pins vdma_sync_signals_passing/m_axis_tvalid] [get_bd_pins xup_and3_2/a]
connect_bd_net [get_bd_pins xup_and3_2/y] [get_bd_pins mog_params_write_async_fifo/s_axis_tvalid]
connect_bd_net [get_bd_pins mog_params_write_async_fifo/s_axis_tready] [get_bd_pins xup_and3_3/c]
connect_bd_net [get_bd_pins xup_and3_3/y] [get_bd_pins vdma_sync_signals_passing/m_axis_tready]
connect_bd_net [get_bd_pins vdma_sync_signals_passing/m_axis_tlast] [get_bd_pins mog_params_write_async_fifo/s_axis_tlast]
connect_bd_net [get_bd_pins vdma_sync_signals_passing/m_axis_tuser] [get_bd_pins mog_params_write_async_fifo/s_axis_tuser]
connect_bd_net [get_bd_pins mog_params_read_async_fifo/axis_overflow] [get_bd_pins axis_overflow]
connect_bd_net [get_bd_pins mog_params_write_async_fifo/axis_underflow] [get_bd_pins axis_underflow]
connect_bd_net [get_bd_pins mog_params_read_async_fifo/axis_underflow] [get_bd_pins axis_underflow1]
connect_bd_net [get_bd_pins vdma_sync_signals_passing/axis_overflow] [get_bd_pins axis_overflow1]
connect_bd_net [get_bd_pins vdma_sync_signals_passing/axis_underflow] [get_bd_pins axis_underflow2]
connect_bd_net [get_bd_pins mog_params_write_async_fifo/axis_overflow] [get_bd_pins axis_overflow2]
connect_bd_net [get_bd_pins MixtureOfGaussians_0/mean1_up] [get_bd_pins mog_params_packing/mean1_up]
connect_bd_net [get_bd_pins MixtureOfGaussians_0/mean2_up] [get_bd_pins mog_params_packing/mean2_up]
connect_bd_net [get_bd_pins MixtureOfGaussians_0/mean3_up] [get_bd_pins mog_params_packing/mean3_up]
connect_bd_net [get_bd_pins MixtureOfGaussians_0/sd1_up] [get_bd_pins mog_params_packing/sd1_up]
connect_bd_net [get_bd_pins MixtureOfGaussians_0/sd2_up] [get_bd_pins mog_params_packing/sd2_up]
connect_bd_net [get_bd_pins MixtureOfGaussians_0/sd3_up] [get_bd_pins mog_params_packing/sd3_up]
connect_bd_net [get_bd_pins MixtureOfGaussians_0/w1_up] [get_bd_pins mog_params_packing/w1_up]
connect_bd_net [get_bd_pins MixtureOfGaussians_0/w2_up] [get_bd_pins mog_params_packing/w2_up]
connect_bd_net [get_bd_pins MixtureOfGaussians_0/gp_out] [get_bd_pins xlslice_0/Din]
connect_bd_net [get_bd_pins MixtureOfGaussians_0/is_fg] [get_bd_pins is_fg]
connect_bd_net [get_bd_pins axi_lite_clk] \
  [get_bd_pins MixtureOfGaussians_0/s_axi_aclk] [get_bd_pins mog_vdma/s_axi_lite_aclk] [get_bd_pins mog_async_fifo_rst/clk]
connect_bd_net [get_bd_pins axi_resetn] [get_bd_pins MixtureOfGaussians_0/s_axi_aresetn] [get_bd_pins mog_vdma/axi_resetn]

current_bd_instance /bge_unit/mog_params_packing
connect_bd_net [get_bd_pins w2_slice/Dout] [get_bd_pins params_concat/In7]
connect_bd_net [get_bd_pins sd1_slice/Dout] [get_bd_pins params_concat/In3]
connect_bd_net [get_bd_pins mean3_slice/Dout] [get_bd_pins params_concat/In2]
connect_bd_net [get_bd_pins sd2_slice/Dout] [get_bd_pins params_concat/In4]
connect_bd_net [get_bd_pins sd3_slice/Dout] [get_bd_pins params_concat/In5]
connect_bd_net [get_bd_pins mean1_slice/Dout] [get_bd_pins params_concat/In0]
connect_bd_net [get_bd_pins w1_slice/Dout] [get_bd_pins params_concat/In6]
connect_bd_net [get_bd_pins mean2_slice/Dout] [get_bd_pins params_concat/In1]
connect_bd_net -net MixtureOfGuassians_0_mean3_up [get_bd_pins w2_up] [get_bd_pins mean3_slice/Din]
connect_bd_net -net MixtureOfGuassians_0_sd2_up [get_bd_pins w1_up] [get_bd_pins sd2_slice/Din]
connect_bd_net -net MixtureOfGuassians_0_mean1_up [get_bd_pins mean3_up] [get_bd_pins mean1_slice/Din]
connect_bd_net -net MixtureOfGuassians_0_sd3_up [get_bd_pins sd1_up] [get_bd_pins sd3_slice/Din]
connect_bd_net -net MixtureOfGuassians_0_mean2_up [get_bd_pins mean2_up] [get_bd_pins mean2_slice/Din]
connect_bd_net -net MixtureOfGuassians_0_w1_up [get_bd_pins mean1_up] [get_bd_pins w1_slice/Din]
connect_bd_net -net MixtureOfGuassians_0_sd1_up [get_bd_pins sd3_up] [get_bd_pins sd1_slice/Din]
connect_bd_net -net MixtureOfGuassians_0_w2_up [get_bd_pins sd2_up] [get_bd_pins w2_slice/Din]
connect_bd_net [get_bd_pins params_concat/dout] [get_bd_pins dout]

current_bd_instance /bge_unit/mog_params_extraction
connect_bd_net [get_bd_pins w1_selection/dout] [get_bd_pins w1]
connect_bd_net [get_bd_pins sd3_selection/dout] [get_bd_pins mean1]
connect_bd_net [get_bd_pins sd2_selection/dout] [get_bd_pins sd3]
connect_bd_net [get_bd_pins sd1_selection/dout] [get_bd_pins mean2]
connect_bd_net [get_bd_pins w2_selection/dout] [get_bd_pins w2]
connect_bd_net -net mog_params_read_async_fifo_m_axis_tdata [get_bd_pins params] \
  [get_bd_pins mean1_selection/Din] [get_bd_pins mean3_selection/Din] [get_bd_pins sd1_selection/Din] \
  [get_bd_pins sd2_selection/Din] [get_bd_pins sd3_selection/Din] [get_bd_pins w1_selection/Din] \
  [get_bd_pins w2_selection/Din] [get_bd_pins mean2_selection/Din]
connect_bd_net [get_bd_pins mean2_selection/dout] [get_bd_pins sd2]
connect_bd_net -net mean1_concat_dout [get_bd_pins mean1_selection/dout] [get_bd_pins mean3]
connect_bd_net [get_bd_pins mean3_selection/dout] [get_bd_pins sd1]
connect_bd_net [get_bd_pins w1_selection/Dout1] [get_bd_pins w3_selection/A]
connect_bd_net [get_bd_pins w2_selection/Dout1] [get_bd_pins w3_selection/B]
connect_bd_net [get_bd_pins w3_selection/dout] [get_bd_pins w3]

current_bd_instance /bge_unit/mog_params_extraction/mean2_selection
connect_bd_net -net mean1_slice_Dout [get_bd_pins mean2_slice/Dout] [get_bd_pins mean2_concat/In1]
connect_bd_net -net xlconstant_0_dout [get_bd_pins zero16/dout] [get_bd_pins mean2_concat/In0]
connect_bd_net -net mog_params_read_async_fifo_m_axis_tdata [get_bd_pins Din] [get_bd_pins mean2_slice/Din]
connect_bd_net -net mean1_concat_dout [get_bd_pins mean2_concat/dout] [get_bd_pins dout]

current_bd_instance /bge_unit/mog_params_extraction/sd3_selection
connect_bd_net -net mean1_slice_Dout [get_bd_pins sd3_slice/Dout] [get_bd_pins sd3_concat/In1]
connect_bd_net -net xlconstant_0_dout [get_bd_pins zero16/dout] [get_bd_pins sd3_concat/In0]
connect_bd_net -net mog_params_read_async_fifo_m_axis_tdata [get_bd_pins Din] [get_bd_pins sd3_slice/Din]
connect_bd_net -net mean1_concat_dout [get_bd_pins sd3_concat/dout] [get_bd_pins dout]

current_bd_instance /bge_unit/mog_params_extraction/mean3_selection
connect_bd_net -net mean1_slice_Dout [get_bd_pins mean3_slice/Dout] [get_bd_pins mean3_concat/In1]
connect_bd_net -net xlconstant_0_dout [get_bd_pins zero16/dout] [get_bd_pins mean3_concat/In0]
connect_bd_net -net mog_params_read_async_fifo_m_axis_tdata [get_bd_pins Din] [get_bd_pins mean3_slice/Din]
connect_bd_net -net mean1_concat_dout [get_bd_pins mean3_concat/dout] [get_bd_pins dout]

current_bd_instance /bge_unit/mog_params_extraction/mean1_selection
connect_bd_net [get_bd_pins mean1_slice/Dout] [get_bd_pins mean1_concat/In1]
connect_bd_net -net xlconstant_0_dout [get_bd_pins zero16/dout] [get_bd_pins mean1_concat/In0]
connect_bd_net -net mog_params_read_async_fifo_m_axis_tdata [get_bd_pins Din] [get_bd_pins mean1_slice/Din]
connect_bd_net [get_bd_pins mean1_concat/dout] [get_bd_pins dout]

current_bd_instance /bge_unit/mog_params_extraction/sd1_selection
connect_bd_net -net mean1_slice_Dout [get_bd_pins sd1_slice/Dout] [get_bd_pins sd1_concat/In1]
connect_bd_net -net xlconstant_0_dout [get_bd_pins zero16/dout] [get_bd_pins sd1_concat/In0]
connect_bd_net -net mog_params_read_async_fifo_m_axis_tdata [get_bd_pins Din] [get_bd_pins sd1_slice/Din]
connect_bd_net -net mean1_concat_dout [get_bd_pins sd1_concat/dout] [get_bd_pins dout]

current_bd_instance /bge_unit/mog_params_extraction/sd2_selection
connect_bd_net -net mean1_slice_Dout [get_bd_pins sd2_slice/Dout] [get_bd_pins sd2_concat/In1]
connect_bd_net -net xlconstant_0_dout [get_bd_pins zero16/dout] [get_bd_pins sd2_concat/In0]
connect_bd_net -net mog_params_read_async_fifo_m_axis_tdata [get_bd_pins Din] [get_bd_pins sd2_slice/Din]
connect_bd_net -net mean1_concat_dout [get_bd_pins sd2_concat/dout] [get_bd_pins dout]

current_bd_instance /bge_unit/mog_params_extraction/w2_selection
connect_bd_net -net mean1_slice_Dout [get_bd_pins w2_slice/Dout] [get_bd_pins Dout1] [get_bd_pins w2_concat/In1]
connect_bd_net -net xlconstant_0_dout [get_bd_pins zero16/dout] [get_bd_pins w2_concat/In0]
connect_bd_net -net mog_params_read_async_fifo_m_axis_tdata [get_bd_pins Din] [get_bd_pins w2_slice/Din]
connect_bd_net -net mean1_concat_dout [get_bd_pins w2_concat/dout] [get_bd_pins dout]

current_bd_instance /bge_unit/mog_params_extraction/w1_selection
connect_bd_net -net mean1_slice_Dout [get_bd_pins w1_slice/Dout] [get_bd_pins Dout1] [get_bd_pins w1_concat/In1]
connect_bd_net -net xlconstant_0_dout [get_bd_pins zero16/dout] [get_bd_pins w1_concat/In0]
connect_bd_net -net mog_params_read_async_fifo_m_axis_tdata [get_bd_pins Din] [get_bd_pins w1_slice/Din]
connect_bd_net -net mean1_concat_dout [get_bd_pins w1_concat/dout] [get_bd_pins dout]

current_bd_instance /bge_unit/mog_params_extraction/w3_selection
connect_bd_net [get_bd_pins one16/dout] [get_bd_pins one16subw1addw2/A]
connect_bd_net [get_bd_pins w1addw2/S] [get_bd_pins one16subw1addw2/B]
connect_bd_net [get_bd_pins A] [get_bd_pins w1addw2/A]
connect_bd_net [get_bd_pins B] [get_bd_pins w1addw2/B]
connect_bd_net [get_bd_pins w3_concat/dout] [get_bd_pins dout]
connect_bd_net [get_bd_pins one16subw1addw2/S] [get_bd_pins w3_concat/In1]
connect_bd_net [get_bd_pins zero16/dout] [get_bd_pins w3_concat/In0]

current_bd_instance /bge_unit/mog_async_fifo_rst
connect_bd_net [get_bd_pins xlconstant_1/dout] [get_bd_pins pipeline_registers_10/reset_n]
connect_bd_net [get_bd_pins xup_or2_2/y] [get_bd_pins pipeline_registers_10/pipe_in]
connect_bd_net [get_bd_pins pipeline_registers_10/pipe_out] [get_bd_pins aresetn] [get_bd_pins xup_or2_2/b]
connect_bd_net -net processing_system7_0_FCLK_CLK1 [get_bd_pins clk] [get_bd_pins pipeline_registers_10/clk]
connect_bd_net -net video_overlay_unit_m_axis_mm2s_tuser [get_bd_pins tuser] [get_bd_pins xup_or2_2/a]

current_bd_instance /hdmi_sync_signals_passing
connect_bd_net -net pipeline_registers_2_pipe_out [get_bd_pins vblank/pipe_out] [get_bd_pins vblank]
connect_bd_net -net pipeline_registers_4_pipe_out [get_bd_pins hblank/pipe_out] [get_bd_pins hblank]
connect_bd_net -net vbb_system_reset_0_system_reset_n [get_bd_pins reset_n] \
  [get_bd_pins de_pass/reset_n] [get_bd_pins hblank/reset_n] [get_bd_pins vblank/reset_n] [get_bd_pins spdif/reset_n]
connect_bd_net -net vbb_system_reset_0_system_reset [get_bd_pins clk] \
  [get_bd_pins de_pass/clk] [get_bd_pins hblank/clk] [get_bd_pins vblank/clk] [get_bd_pins spdif/clk]
connect_bd_net -net pipeline_registers_5_pipe_out [get_bd_pins spdif/pipe_out] [get_bd_pins spdif]
connect_bd_net -net image_smoothing_full_version_0_Hblank_out1 [get_bd_pins hblank_in] [get_bd_pins hblank/pipe_in]
connect_bd_net -net In2_2 [get_bd_pins de_in] [get_bd_pins de_pass/pipe_in]
connect_bd_net -net image_smoothing_full_version_0_Vblank_out1 [get_bd_pins vblank_in] [get_bd_pins vblank/pipe_in]
connect_bd_net -net image_smoothing_full_version_0_spdif_out [get_bd_pins spdif_in] [get_bd_pins spdif/pipe_in]
connect_bd_net -net pipeline_registers_1_pipe_out [get_bd_pins de_pass/pipe_out] [get_bd_pins de]

current_bd_instance /color_video_pass
connect_bd_net -net vovrly_async_fifo_rst_wr_en [get_bd_pins color_video_pass_fifo_wr_en/wr_en] [get_bd_pins color_video_pass_fifo/wr_en]
connect_bd_net -net color_video_pass_fifo_wr_en1_rd_en [get_bd_pins color_video_pass_fifo_rd_en/rd_en] [get_bd_pins color_video_pass_fifo/rd_en]
connect_bd_net -net vbb_system_reset_0_system_reset [get_bd_pins rst] [get_bd_pins color_video_pass_fifo/rst]
connect_bd_net [get_bd_pins clk] \
  [get_bd_pins color_video_pass_fifo/clk] [get_bd_pins color_video_pass_fifo_wr_en/clk] \
  [get_bd_pins color_video_pass_fifo_rd_en/clk]
connect_bd_net -net In2_1 [get_bd_pins de_in_wr] [get_bd_pins color_video_pass_fifo_wr_en/de_in]
connect_bd_net -net Morphology_0_de_out [get_bd_pins de_in_rd] [get_bd_pins color_video_pass_fifo_rd_en/de_in]
connect_bd_net [get_bd_pins reset_n] [get_bd_pins color_video_pass_fifo_rd_en/reset_n] [get_bd_pins color_video_pass_fifo_wr_en/reset_n]
connect_bd_net [get_bd_pins color_video_pass_fifo/full] [get_bd_pins full]
connect_bd_net [get_bd_pins color_video_pass_fifo/empty] [get_bd_pins empty]
connect_bd_net -net din1_1 [get_bd_pins ycbcr_orig] [get_bd_pins color_video_pass_fifo/din]
connect_bd_net [get_bd_pins color_video_pass_fifo/dout] [get_bd_pins ycbcr_out]
